# Altium schematic sheet eps_batt.SchDoc
size A4
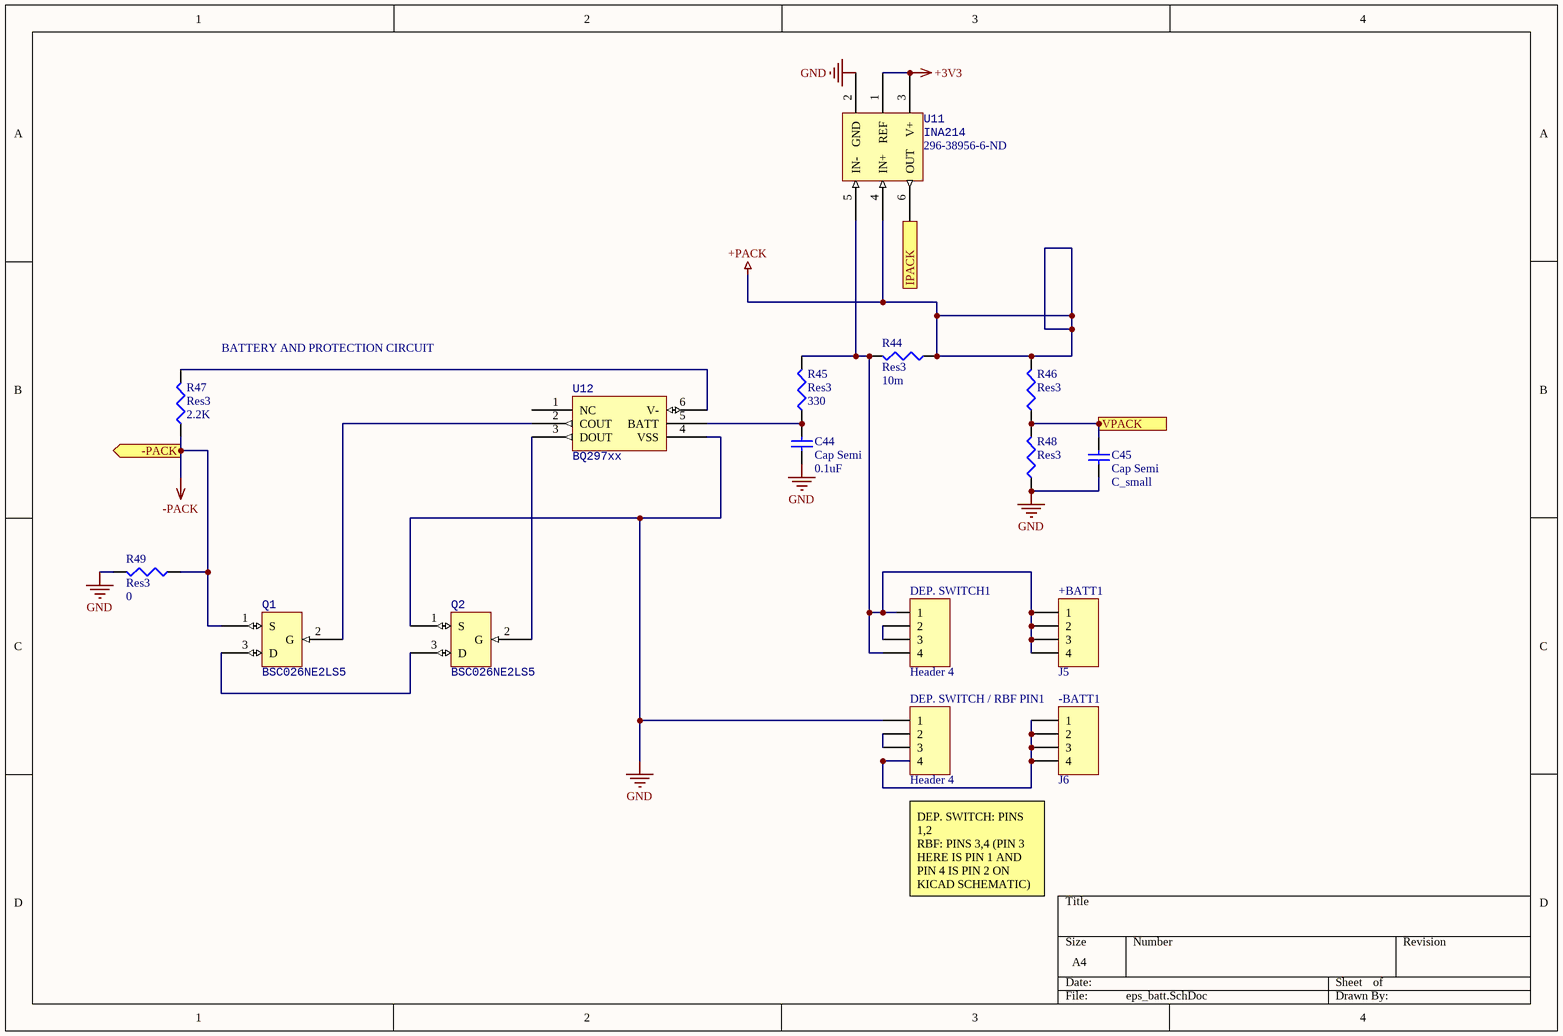
[diagram p0: eps_batt.SchDoc]

## Parts
+BATT1  J5  [DF14-4P-1.25H(55)]
-BATT1  J6  [DF14-4P-1.25H(55)]
C44  Cap Semi  value 0.1uF  [1608[0603]]
C45  Cap Semi  value C_small  [1608[0603]]
DEP._SWITCH1  Header 4  [DF14-4P-1.25H(55)]
DEP._SWITCH_/_RBF_PIN1  Header 4  [DF14-4P-1.25H(55)]
Q1  BSC026NE2LS5  [INF-PG-TDSON-8-1_V]
Q2  BSC026NE2LS5  [INF-PG-TDSON-8-1_V]
R44  Res3  value 10m  [J1-0603]
R45  Res3  value 330  [J1-0603]
R46  Res3  [J1-0603]
R47  Res3  value 2.2K  [J1-0603]
R48  Res3  [J1-0603]
R49  Res3  value 0  [J1-0603]
U11  INA214  Supplier Part Number 1: 296-38956-6-ND  [SOT65P210X110-6N]
U12  BQ297xx  [SON50P150X150X80-6N - duplicate1]

## Ports
-PACK (out), IPACK (out), VPACK (in)

## Nets
+3V3: U11.1(REF) U11.3(V+)
+PACK: R44.1 R46.2 U11.4(IN+)
-PACK: Q1.1(S) R47.1 R49.1 ; port -PACK
GND: C44.1 C45.1 DEP._SWITCH_/_RBF_PIN1.1 Q2.1(S) R48.1 R49.2 U11.2(GND) U12.4(VSS)
IPACK: U11.6(OUT) ; port IPACK
VPACK: C45.2 R46.1 R48.2 ; port VPACK
Net+BATT1_1: +BATT1.1 +BATT1.2 +BATT1.3 +BATT1.4 DEP._SWITCH1.1 DEP._SWITCH1.4 R44.2 R45.2 U11.5(IN-)
Net-BATT1_1: -BATT1.1 -BATT1.2 -BATT1.3 -BATT1.4 DEP._SWITCH_/_RBF_PIN1.4
NetC44_2: C44.2 R45.1 U12.5(BATT)
NetDEP._SWITCH1_2: DEP._SWITCH1.2 DEP._SWITCH1.3
NetDEP._SWITCH_/_RBF_PIN1_2: DEP._SWITCH_/_RBF_PIN1.2 DEP._SWITCH_/_RBF_PIN1.3
NetQ1_2: Q1.2(G) U12.2(COUT)
NetQ1_3: Q1.3(D) Q2.3(D)
NetQ2_2: Q2.2(G) U12.3(DOUT)
NetR47_2: R47.2 U12.6(V-)

Not connected (* = marked no-connect by the designer): U12 1(NC)

## Notes on the sheet
- (near R47) BATTERY AND PROTECTION CIRCUIT
- DEP. SWITCH: PINS 1,2
  RBF: PINS 3,4 (PIN 3 HERE IS PIN 1 AND PIN 4 IS PIN 2 ON KICAD SCHEMATIC)

## Library data of the parts
+BATT1 -BATT1 DEP._SWITCH1 DEP._SWITCH_/_RBF_PIN1 = Header 4: Header, 4-Pin; LatestRevisionDate: 17-Jul-2002; LatestRevisionNote: Re-released for DXP Platform.; Publisher: Altium Limited; ComponentLink1Description: Hirose DF14-4P-1.25H(55) Right Angle; ComponentLink1URL: https://www.digikey.ca/product-detail/en/hirose-electric-co-ltd/DF14-4P-1.25H-55/H10317-ND/964472
C44 C45 = Cap Semi: Capacitor (Semiconductor SIM Model); Published: 8-Jun-2000; LatestRevisionDate: 29-May-2009; LatestRevisionNote: IPC-7351 Footprint Added.; PackageReference: C1206; Publisher: Altium Limited; PackageDescription: Chip Capacitor
Q1 Q2 = BSC026NE2LS5: MOSFET; ComponentLink1Description: N-Channel Mosfet; ComponentLink1URL: https://www.digikey.ca/product-detail/en/infineon-technologies/BSC026NE2LS5ATMA1/BSC026NE2LS5ATMA1DKR-ND/6564538
R44-R49 = Res3: Resistor; Published: 8-Jun-2000; LatestRevisionDate: 29-May-2009; LatestRevisionNote: IPC-7351 Footprint Added.; PackageReference: J1-0603; Publisher: Altium Limited; PackageDescription: Chip Resistor
U11 = INA214: Current monitor; Supplier 1: Digi-Key; ComponentLink1Description: IC Current Monitor; ComponentLink1URL: https://www.digikey.ca/product-detail/en/texas-instruments/INA214AIDCKR/296-38956-1-ND/5143051
U12 = BQ2972: Battery protection; ComponentLink1Description: Charge Controller; ComponentLink1URL: https://www.digikey.com/product-detail/en/texas-instruments/BQ29729DSET/296-44131-1-ND/6005144